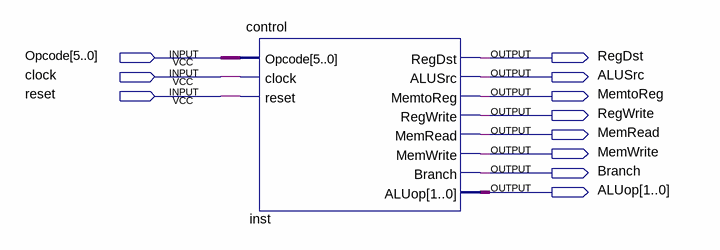
[diagram p0: schematic sheet]
// Quartus schematic control_unit_block_diagram.bdf as structural Verilog: 1 symbols, 11 pins
module control_unit_block_diagram (
  input  [5:0] Opcode,
  input  clock,
  input  reset,
  output RegDst,
  output ALUSrc,
  output MemtoReg,
  output RegWrite,
  output MemRead,
  output MemWrite,
  output Branch,
  output [1:0] ALUop
);

  control inst (
    .Opcode(Opcode), .clock(clock), .reset(reset), .RegDst(RegDst), .ALUSrc(ALUSrc), .MemtoReg(MemtoReg),
    .RegWrite(RegWrite), .MemRead(MemRead), .MemWrite(MemWrite), .Branch(Branch), .ALUop(ALUop));
endmodule
